# Altium schematic sheet PR_Schema.SchDoc
size 420 x 297 mm; SheetNumber: 1; SheetTotal: 1; DocumentName: Sheet1.SCHDOC
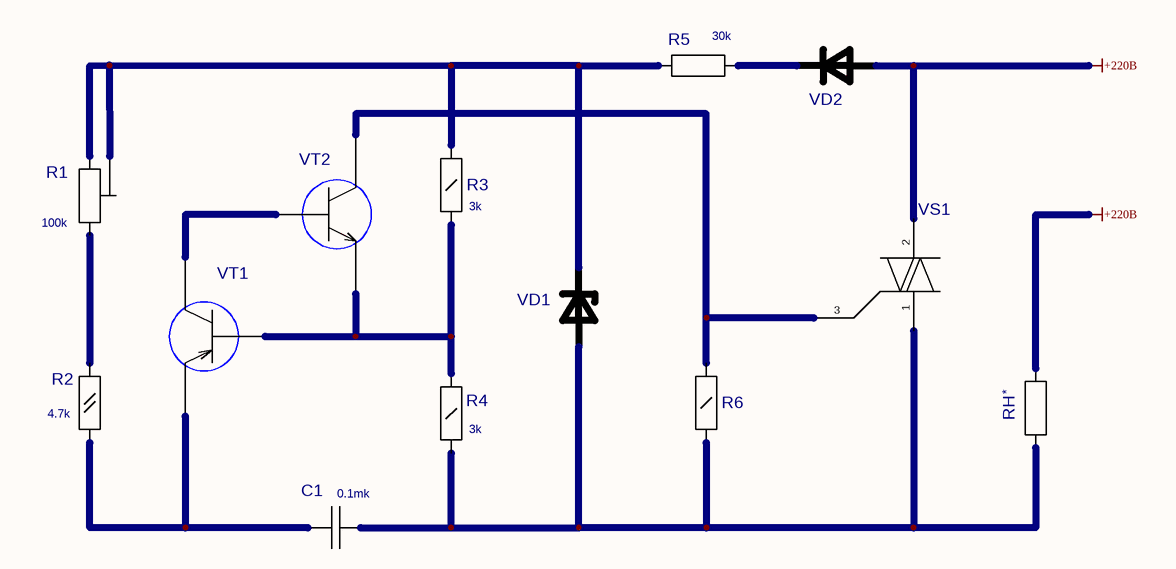
[diagram p0: PR_Schema.SchDoc]

## Parts
C1  value 0.1mk  [1812_DIP]  (hidden comment: К10-17БИМП-NP0-0,01МКФ-1812)
R1  value 100k  [3006P]  (hidden comment: 3006W)
R2  value 4.7k  [C2-33H-0.125W]  (hidden comment: C2-33H-0.125W_OLD_UGO)
R3  value 3k  [C2-33H-0.25W]  (hidden comment: C2-33H-0.25W_OLD_UGO)
R4  value 3k  [C2-33H-0.25W]  (hidden comment: C2-33H-0.25W_OLD_UGO)
R5  value 30k  [C5-16MB-5BT]  (hidden comment: C5-16MB-5BT)
R6  C2-33H-0.25W_OLD_UGO  [C2-33H-0.25W]  (value not drawn)
RH  C5-16MB-5BT  [C5-16MB-5BT]  (value not drawn)
VD1  BZX55-C30V  [DO-35]  (value not drawn)
VD2  КД105Б  [КД105]  (value not drawn)
VS1  TC106  [KT-27]  (value not drawn)
VT1  КТ361А  [KT13]  (value not drawn)
VT2  КТ315А  [KT13]  (value not drawn)

## Nets
+220B: RH.2 VD2.A VS1.2(E2)
NetC1_1: C1.1 R2.2 VT1.1(E)
NetC1_2: C1.2 R4.1 R6.1 RH.1 VD1.A VS1.1(E1)
NetR1_1: R1.1 R2.1
NetR1_2: R1.2 R1.3 R3.2 R5.1 VD1.K
NetR3_1: R3.1 R4.2 VT1.2(B) VT2.1(E)
NetR5_2: R5.2 VD2.K
NetR6_2: R6.2 VS1.3(Ue) VT2.3(K)
NetVT1_3: VT1.3(K) VT2.2(B)

## Library data of the parts
R2 = C2-33H-0.125W_OLD_UGO: Autor: pcbdesigner.ru
R3 R4 R6 = C2-33H-0.25W_OLD_UGO: Autor: pcbdesigner.ru
  R6: Value: *
R5 RH = C5-16MB-5BT
  RH: Value: *
VD1 = BZX55-C30V: Value: *
VD2 = КД105Б: Value: *
VS1 = TC106: Value: *
VT1 = КТ361А: Value: *
VT2 = КТ315А: Value: *